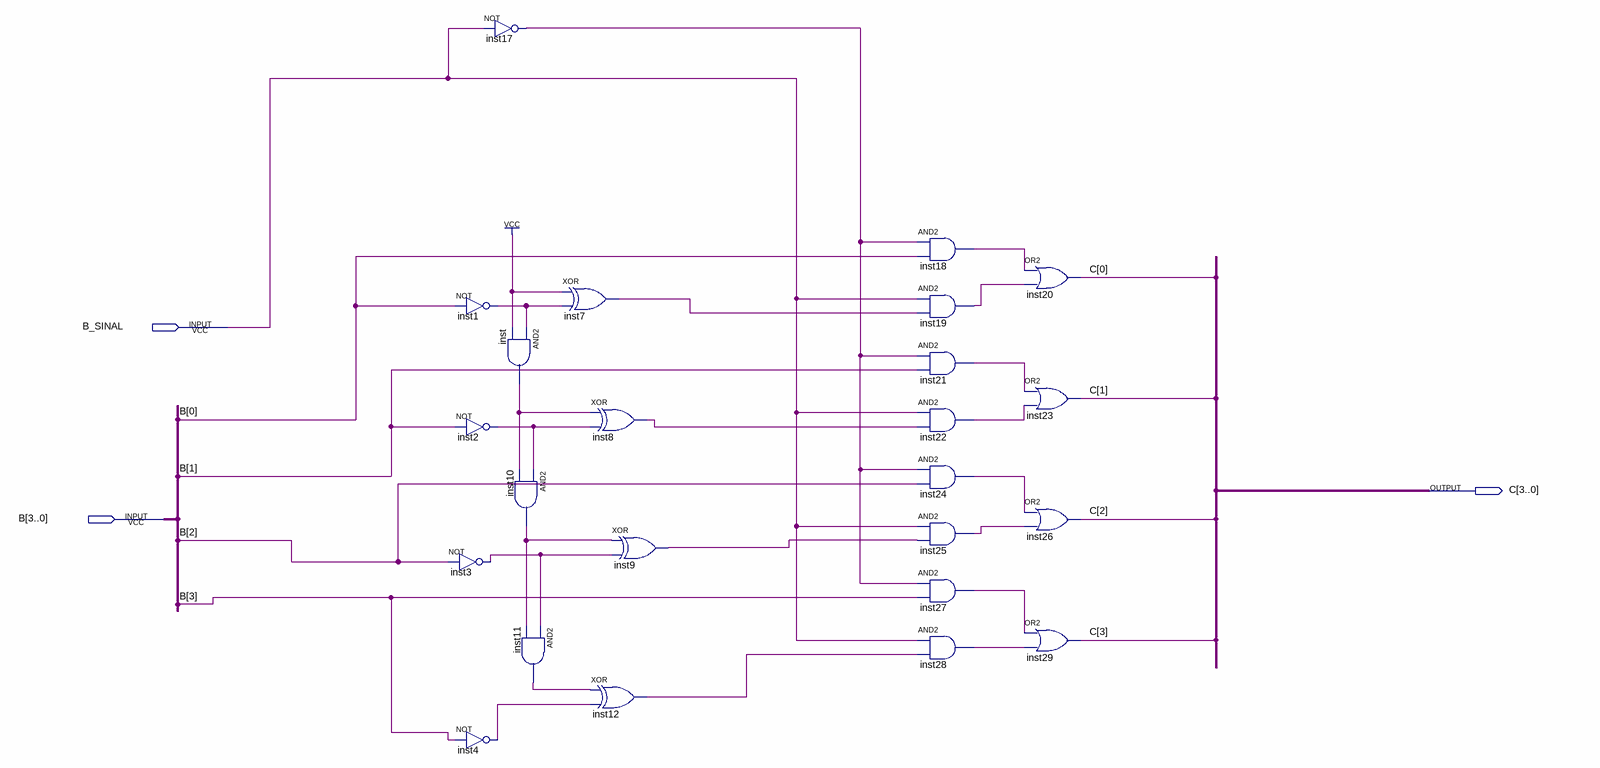
[diagram p0: schematic sheet]
// Quartus schematic Complemento24Bits.bdf as structural Verilog: 24 symbols, 3 pins
module Complemento24Bits (
  input  B_SINAL,
  input  [3:0] B,
  output [3:0] C
);

  wire inst1_out, inst2_out, inst3_out, inst4_out, inst7_out, inst8_out, inst9_out, inst10_out, inst11_out,
       inst12_out, inst17_out, inst18_out, inst19_out, inst21_out, inst22_out, inst24_out, inst25_out,
       inst27_out, inst28_out, inst_out;

  not inst1 (inst1_out, B[0]);
  not inst2 (inst2_out, B[1]);
  not inst3 (inst3_out, B[2]);
  not inst4 (inst4_out, B[3]);
  not inst17 (inst17_out, B_SINAL);
  and inst (inst_out, inst1_out, 1'b1);
  and inst10 (inst10_out, inst2_out, inst_out);
  and inst11 (inst11_out, inst3_out, inst10_out);
  xor inst7 (inst7_out, 1'b1, inst1_out);
  xor inst8 (inst8_out, inst_out, inst2_out);
  xor inst9 (inst9_out, inst10_out, inst3_out);
  xor inst12 (inst12_out, inst11_out, inst4_out);
  and inst18 (inst18_out, inst17_out, B[0]);
  and inst19 (inst19_out, B_SINAL, inst7_out);
  and inst21 (inst21_out, inst17_out, B[1]);
  and inst22 (inst22_out, B_SINAL, inst8_out);
  and inst24 (inst24_out, inst17_out, B[2]);
  and inst25 (inst25_out, B_SINAL, inst9_out);
  and inst27 (inst27_out, inst17_out, B[3]);
  and inst28 (inst28_out, B_SINAL, inst12_out);
  or inst20 (C[0], inst18_out, inst19_out);
  or inst23 (C[1], inst21_out, inst22_out);
  or inst26 (C[2], inst24_out, inst25_out);
  or inst29 (C[3], inst27_out, inst28_out);
endmodule
